# Altium schematic sheet RX_old.SchDoc: {Наименование}
size 420 x 297 mm; DocumentNumber: ПЛАС.ХХХХХХ.ХХХ ХХ; SheetNumber: {}; SheetTotal: {}; PageSetup: Record=PageOptions|CenterHorizontal=False|CenterVertical=False|PrintScale=0.95|XCorrection=0.00|YCorrection=0.00|PrintKind=1|BorderSize=5000000|LeftOffset=0|BottomOffset=0|Orientation=1|PaperLength=1000|PaperWidth=1000|Scale=100|PaperSource=15|PrintQuality=600|MediaType=1|DitherType=10|PaperKind=A4|PrintScaleMode=1; Rule: PcbType=ProtelPcb
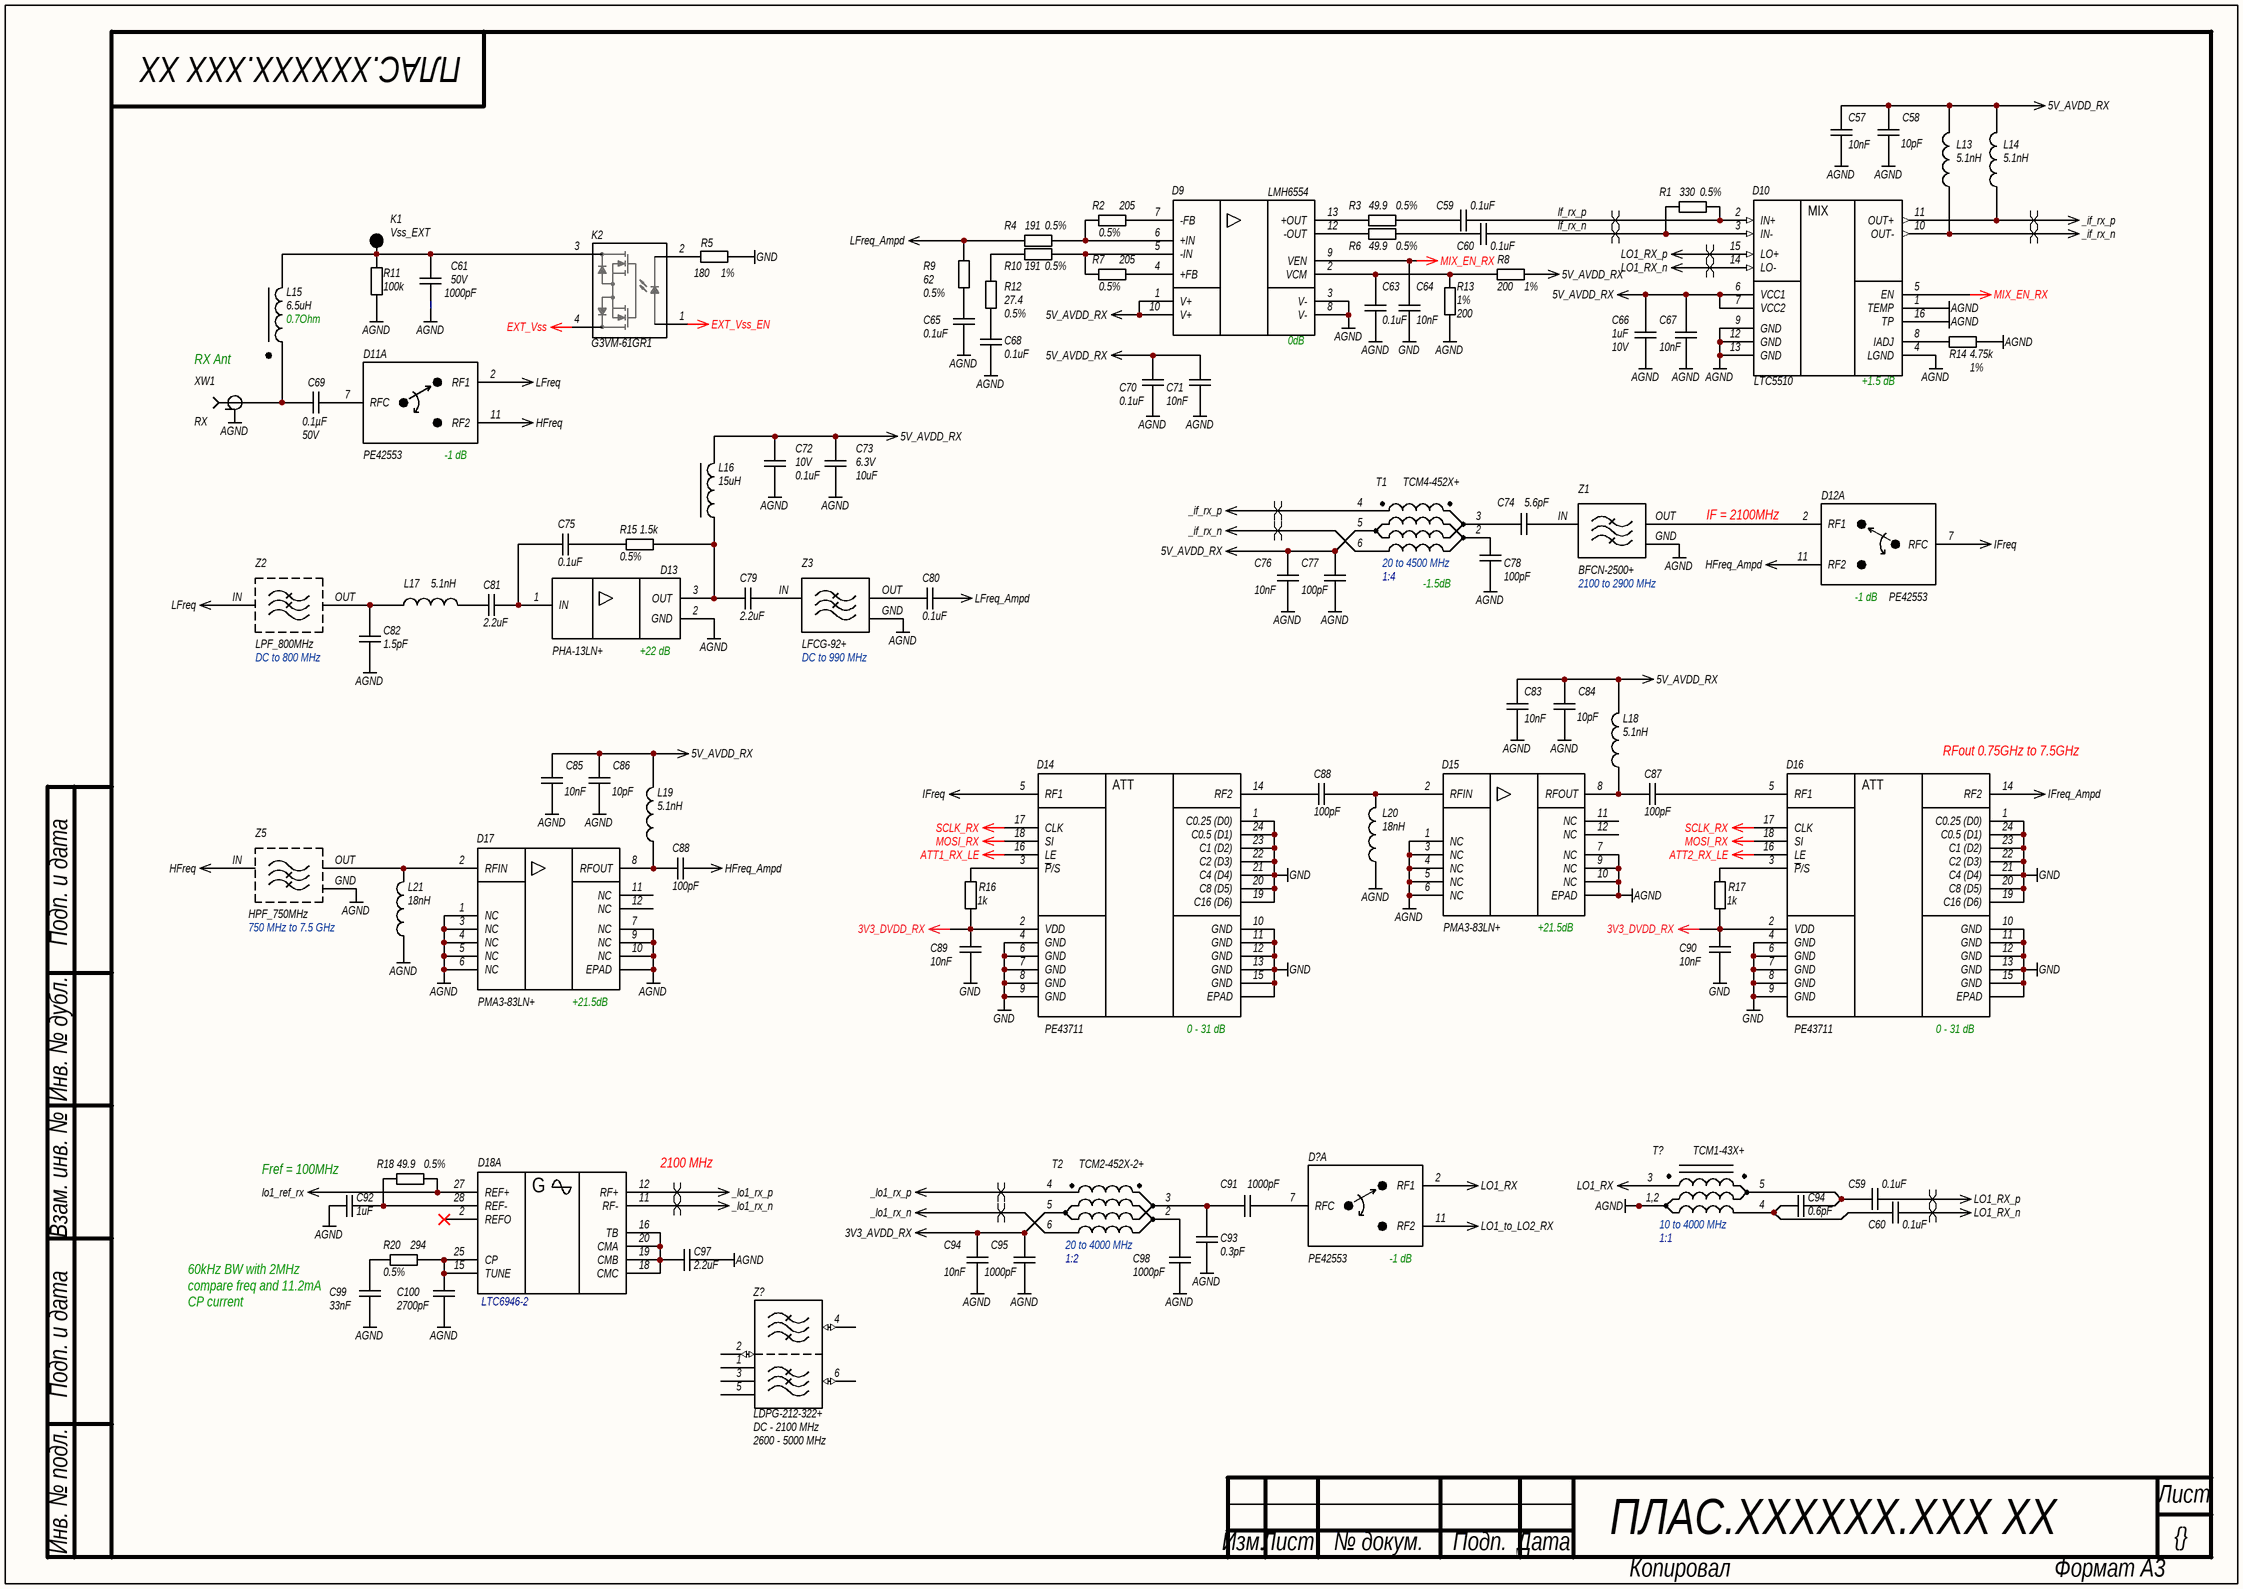
[diagram p0: RX_old.SchDoc]

## Parts
(Parts that share a designator on the sheet are numbered #1, #2 ... from top to bottom, then left to right.)
C57  value 10nF  [C0402]  (hidden comment: CAP)
C58  value 10pF  [C0402]  (hidden comment: CAP)
C59#1  value 0.1uF  [C0402]  (hidden comment: CAP)
C59#2  value 0.1uF  [C0402]  (hidden comment: CAP)
C60#1  value 0.1uF  [C0402]  (hidden comment: CAP)
C60#2  value 0.1uF  [C0402]  (hidden comment: CAP)
C61  value 1000pF  Voltage: 50V  [C0402]  (hidden comment: CAP)
C63  value 0.1uF  [C0402]  (hidden comment: CAP)
C64  value 10nF  [C0402]  (hidden comment: CAP)
C65  value 0.1uF  [C0402]  (hidden comment: CAP)
C66  value 1uF  Voltage: 10V  [C0805]  (hidden comment: CAP)
C67  value 10nF  [C0402]  (hidden comment: CAP)
C68  value 0.1uF  [C0402]  (hidden comment: CAP)
C69  value 0.1µF  Voltage: 50V  [C1206]  (hidden comment: CAP)
C70  value 0.1uF  [C0402]  (hidden comment: CAP)
C71  value 10nF  [C0402]  (hidden comment: CAP)
C72  value 0.1uF  Voltage: 10V  [C0402]  (hidden comment: CAP)
C73  value 10uF  Voltage: 6.3V  [C0805]  (hidden comment: CAP)
C74  value 5.6pF  [C0402]  (hidden comment: CAP)
C75  value 0.1uF  [C0402]  (hidden comment: CAP)
C76  value 10nF  [C0402]  (hidden comment: CAP)
C77  value 100pF  [C0402]  (hidden comment: CAP)
C78  value 100pF  [C0402]  (hidden comment: CAP)
C79  value 2.2uF  [C0603]  (hidden comment: CAP)
C80  value 0.1uF  [C0402]  (hidden comment: CAP)
C81  value 2.2uF  [C0603]  (hidden comment: CAP)
C82  value 1.5pF  [C0402]  (hidden comment: CAP)
C83  value 10nF  [C0402]  (hidden comment: CAP)
C84  value 10pF  [C0402]  (hidden comment: CAP)
C85  value 10nF  [C0402]  (hidden comment: CAP)
C86  value 10pF  [C0402]  (hidden comment: CAP)
C87  value 100pF  [C0402]  (hidden comment: CAP)
C88#1  value 100pF  [C0402]  (hidden comment: CAP)
C88#2  value 100pF  [C0402]  (hidden comment: CAP)
C89  value 10nF  [C0402]  (hidden comment: CAP)
C90  value 10nF  [C0402]  (hidden comment: CAP)
C91  value 1000pF  [C0402]  (hidden comment: CAP)
C92  value 1uF  [C0805]  (hidden comment: CAP)
C93  value 0.3pF  [C0402]  (hidden comment: CAP)
C94#1  value 0.6pF  [C0402]  (hidden comment: CAP)
C94#2  value 10nF  [C0402]  (hidden comment: CAP)
C95  value 1000pF  [C0402]  (hidden comment: CAP)
C97  value 2.2uF  [C0603]  (hidden comment: CAP)
C98  value 1000pF  [C0402]  (hidden comment: CAP)
C99  value 33nF  [C1206]  (hidden comment: CAP)
C100  value 2700pF  [C0805]  (hidden comment: CAP)
D9  LMH6554  [UQFN-14_2]
D10  LTC5510  [PQFN-16]
D11  PE42553  [QFN-16]  (part A of 2)
D12  PE42553  [QFN-16]  (part A of 2)
D13  PHA-13LN+  [SOT89]
D14  PE43711  [QFN-24]
D15  PMA3-83LN+  [DQ1225]
D16  PE43711  [QFN-24]
D17  PMA3-83LN+  [DQ1225]
D18  Name: LTC6946-2  [QFN-28]  (hidden comment: LTC6946)  (part A of 2)
D?  PE42553  [QFN-16]  (part A of 2)
K1  Vss_EXT  [Control Point]
K2  G3VM-61GR1  [G3VM-61]
L13  value 5.1nH  [L0603_HP]  (hidden comment: Inductor RF)
L14  value 5.1nH  [L0603_HP]  (hidden comment: Inductor RF)
L15  value 6.5uH  DCR: 0.7Ohm  [BCR-272]  (hidden comment: Inductor_BCR)
L16  value 15uH  [L1008_LS]  (hidden comment: Inductor)
L17  value 5.1nH  [L0603_HP]  (hidden comment: Inductor RF)
L18  value 5.1nH  [L0603_HP]  (hidden comment: Inductor RF)
L19  value 5.1nH  [L0603_HP]  (hidden comment: Inductor RF)
L20  value 18nH  [L0603_HP]  (hidden comment: Inductor RF)
L21  value 18nH  [L0402]  (hidden comment: Inductor RF)
R1  value 330  Tolerance: 0.5%  [R0402]  (hidden comment: RES)
R2  value 205  Tolerance: 0.5%  [R0402]  (hidden comment: RES)
R3  value 49.9  Tolerance: 0.5%  [R0402]  (hidden comment: RES)
R4  value 191  Tolerance: 0.5%  [R0402]  (hidden comment: RES)
R5  value 180  Tolerance: 1%  [R0402]  (hidden comment: RES)
R6  value 49.9  Tolerance: 0.5%  [R0402]  (hidden comment: RES)
R7  value 205  Tolerance: 0.5%  [R0402]  (hidden comment: RES)
R8  value 200  Tolerance: 1%  [R0402]  (hidden comment: RES)
R9  value 62  Tolerance: 0.5%  [R0402]  (hidden comment: RES)
R10  value 191  Tolerance: 0.5%  [R0402]  (hidden comment: RES)
R11  value 100k  [R0402]  (hidden comment: RES)
R12  value 27.4  Tolerance: 0.5%  [R0402]  (hidden comment: RES)
R13  value 200  Tolerance: 1%  [R0402]  (hidden comment: RES)
R14  value 4.75k  Tolerance: 1%  [R0402]  (hidden comment: RES)
R15  value 1.5k  Tolerance: 0.5%  [R0402]  (hidden comment: RES)
R16  value 1k  [R0402]  (hidden comment: RES)
R17  value 1k  [R0402]  (hidden comment: RES)
R18  value 49.9  Tolerance: 0.5%  [R0402]  (hidden comment: RES)
R20  value 294  Tolerance: 0.5%  [R0603]  (hidden comment: RES)
T1  TCM4-452X+  Frequency: 20 to 4500 MHz  Ratio: 1:4  [DB1627]
T2  TCM2-452X-2+  Frequency: 20 to 4000 MHz  Ratio: 1:2  [DB1627]
T?  TCM1-43X+  Frequency: 10 to 4000 MHz  Ratio: 1:1  [DB1627]
XW1  RX  [MOLEX SD-73251-135 (Gold)]
Z1  BFCN-2500+  Frequency: 2100 to 2900 MHz  [FV1206-4]
Z2  LPF_800MHz  Frequency: DC to 800 MHz  [LPF_800MHz_305um]  (net tie, no BOM)
Z3  LFCG-92+  Frequency: DC to 990 MHz  [GE0805C-2]
Z5  HPF_750MHz  Frequency: 750 MHz to 7.5 GHz  [HPF_750_305um]  (net tie)
Z?  LDPG-212-322+  Low Pass: DC - 2100 MHz  High Pass: 2600 - 5000 MHz  [GE0805C-10]

## Nets
3V3_AVDD_RX: C94#2.2 C95.1 T2.5
3V3_DVDD_RX: C89.2 C90.2 D14.2(VDD) D16.2(VDD) R16.1 R17.1
5V_AVDD_RX: C57.2 C58.2 C66.1 C67.2 C70.2 C71.2 C72.2 C73.2 C76.2 C77.2 C83.2 C84.2 C85.1 C86.2 D9.1(V+) D9.10(V+) D10.6(VCC1) D10.7(VCC2) L13.2 L14.2 L16.2 L18.2 L19.2 R8.2 T1.5
_if_rx_n: D10.10(OUT-) L13.1 T1.6
_if_rx_p: D10.11(OUT+) L14.1 T1.4
_lo1_rx_n: D18.11(RF-) T2.6
_lo1_rx_p: D18.12(RF+) T2.4
AGND: C57.1 C58.1 C61.1 C63.1 C65.2 C66.2 C67.1 C68.2 C70.1 C71.1 C72.1 C73.1 C76.1 C77.1 C78.1 C82.1 C83.1 C84.1 C85.2 C86.1 C92.2 C93.1 C94#2.1 C95.2 C97.1 C98.2 C99.1 C100.1 D9.3(V-) D9.8(V-) D10.1(TEMP) D10.4(LGND) D10.9(GND) D10.12(GND) D10.13(GND) D10.16(TP) D13.2(GND) D15.1(NC) D15.3(NC) D15.4(NC) D15.5(NC) D15.6(NC) D15.7(NC) D15.9(NC) D15.10(NC) D15.13(EPAD) D17.1(NC) D17.3(NC) D17.4(NC) D17.5(NC) D17.6(NC) D17.7(NC) D17.9(NC) D17.10(NC) D17.13(EPAD) L20.1 L21.1 R11.1 R13.2 R14.1 T?.1(1,2) T?.2 XW1.G(GND) Z1.GND Z3.GND Z5.GND
ATT1_RX_LE: D14.16(LE)
ATT2_RX_LE: D16.16(LE)
EXT_Vss: K2.4
EXT_Vss_EN: K2.1
GND: C64.1 C89.1 C90.1 D14.1(C0.25_(D0)) D14.4(GND) D14.6(GND) D14.7(GND) D14.8(GND) D14.9(GND) D14.10(GND) D14.11(GND) D14.12(GND) D14.13(GND) D14.15(GND) D14.19(C16_(D6)) D14.20(C8_(D5)) D14.21(C4_(D4)) D14.22(C2_(D3)) D14.23(C1_(D2)) D14.24(C0.5_(D1)) D14.25(EPAD) D16.1(C0.25_(D0)) D16.4(GND) D16.6(GND) D16.7(GND) D16.8(GND) D16.9(GND) D16.10(GND) D16.11(GND) D16.12(GND) D16.13(GND) D16.15(GND) D16.19(C16_(D6)) D16.20(C8_(D5)) D16.21(C4_(D4)) D16.22(C2_(D3)) D16.23(C1_(D2)) D16.24(C0.5_(D1)) D16.25(EPAD) R5.2
HFreq: D11.11(RF2) Z5.IN
HFreq_Ampd: C88#2.2 D12.11(RF2)
IFreq: D12.7(RFC) D14.5(RF1)
IFreq_Ampd: D16.14(RF2)
LFreq: D11.2(RF1) Z2.IN
LFreq_Ampd: C80.1 R4.2 R9.2
lo1_ref_rx: D18.27(REF+) R18.1
LO1_RX: D?.2(RF1) T?.3
LO1_RX_n: C60#2.1 D10.14(LO-)
LO1_RX_p: C59#2.1 D10.15(LO+)
LO1_to_LO2_RX: D?.11(RF2)
MIX_EN_RX: C64.2 D9.9(VEN) D10.5(EN)
MOSI_RX: D14.18(SI) D16.18(SI)
SCLK_RX: D14.17(CLK) D16.17(CLK)
lf_rx_n: C60#1.1 D10.3(IN-) R1.1
lf_rx_p: C59#1.1 D10.2(IN+) R1.2
NetC59#1_2: C59#1.2 R3.1
NetC59#2_2: C59#2.2 C94#1.2 T?.5
NetC60#1_2: C60#1.2 R6.1
NetC60#2_2: C60#2.2 C94#1.1 T?.4
NetC61_2: C61.2 K1.1 K2.3 L15.2 R11.2
NetC63_2: C63.2 D9.2(VCM) R8.1 R13.1
NetC65_1: C65.1 R9.1
NetC68_1: C68.1 R12.1
NetC69_1: C69.1 L15.1 XW1.S(RF)
NetC69_2: C69.2 D11.7(RFC)
NetC74_1: C74.1 Z1.IN
NetC74_2: C74.2 T1.3
NetC75_1: C75.1 C81.2 D13.1(IN)
NetC75_2: C75.2 R15.2
NetC78_2: C78.2 T1.2
NetC79_1: C79.1 D13.3(OUT) L16.1 R15.1
NetC79_2: C79.2 Z3.IN
NetC80_2: C80.2 Z3.OUT
NetC81_1: C81.1 L17.2
NetC82_2: C82.2 L17.1 Z2.OUT
NetC87_1: C87.1 D15.8(RFOUT) L18.1
NetC87_2: C87.2 D16.5(RF1)
NetC88#1_1: C88#1.1 D14.14(RF2)
NetC88#1_2: C88#1.2 D15.2(RFIN) L20.2
NetC88#2_1: C88#2.1 D17.8(RFOUT) L19.1
NetC91_1: C91.1 C93.2 T2.3
NetC91_2: C91.2 D?.7(RFC)
NetC92_1: C92.1 D18.28(REF-) R18.2
NetC97_2: C97.2 D18.16(TB) D18.18(CMC) D18.19(CMB) D18.20(CMA)
NetC98_1: C98.1 T2.2
NetC99_2: C99.2 R20.2
NetC100_2: C100.2 D18.15(TUNE) D18.25(CP) R20.1
NetD9_4: D9.4(+FB) R7.2
NetD9_5: D9.5(-IN) R7.1 R10.1
NetD9_6: D9.6(+IN) R2.1 R4.1
NetD9_7: D9.7(-FB) R2.2
NetD9_12: D9.12(-OUT) R6.2
NetD9_13: D9.13(+OUT) R3.2
NetD10_8: D10.8(IADJ) R14.2
NetD12_2: D12.2(RF1) Z1.OUT
NetD14_3: D14.3(~{P}/S) R16.2
NetD16_3: D16.3(~{P}/S) R17.2
NetD17_2: D17.2(RFIN) L21.2 Z5.OUT
NetK2_2: K2.2 R5.1
NetR10_2: R10.2 R12.2

Not connected (* = marked no-connect by the designer): D15 11(NC) 12(NC); D17 11(NC) 12(NC); D18 2(REFO)*; Z? 1(GND) 2 3(GND) 4 5(GND) 6

## Layout directives
differential pair: _if_rx_n, _if_rx_p, _lo1_rx_n, _lo1_rx_p, lf_rx_n, lf_rx_p, LO1_RX_n, LO1_RX_p

## Notes on the sheet
- RX Ant
- (near D9) 0dB
- (near D12) IF = 2100MHz
- -1.5dB
- (near D16) RFout 0.75GHz to 7.5GHz
- Fref = 100MHz
- (near D18) 2100 MHz
- 60kHz BW with 2MHz compare freq and 11.2mA CP current
- Подп. и дата
- Инв. № дубл.
- Взам. инв. №
- Инв. № подл.
- Лист
- Изм.
- № докум.
- Подп.
- Дата
- Копировал
- Формат А3
- (in symbol LTC5510) MIX; +1.5 dB
- (in symbol LTC6946, part A) G
- (in symbol PE42553, part A) -1 dB
- (in symbol PE43711) ATT; 0 - 31 dB
- (in symbol PHA-13LN+) +22 dB
- (in symbol PMA3-83LN+) +21.5dB

## Library data of the parts
C57 C64 C67 C71 C76 C83 C89 C90 C94#2 = CAP: SMD Capacitor; Manufacturer: Murata; Material: X7R; Tolerance: 10%; Voltage: 25V; Type: Ceramic Capacitor; P/N: GRM155R71E103KA01D
C58 C84 C86 = CAP: SMD Capacitor; Manufacturer: Murata; Material: NP0; Tolerance: 1%; Voltage: 50V; Type: Ceramic Capacitor; P/N: GRM1555C1H100FA01D
C59#1 C59#2 C60#1 C60#2 C63 C65 C68 C70 C75 C80 = CAP: SMD Capacitor; Manufacturer: Murata; Material: X7R; Tolerance: 10%; Voltage: 10V; Type: Ceramic Capacitor; P/N: GRM155R71A104KA01J
C61 = CAP: SMD Capacitor; Manufacturer: Murata; Material: NP0; Tolerance: 5%; Type: Ceramic Capacitor; P/N: GRM1555C1H102JA01D
C66 = CAP: SMD Capacitor; Manufacturer: Murata; Material: X7R; Tolerance: 10%; Type: Ceramic Capacitor; P/N: GRM21BR71A105KA01K
C69 = CAP: SMD Capacitor; Manufacturer: Murata; Material: NP0; Tolerance: 5%; Type: Ceramic Capacitor; P/N: GRM31C5C1H104JA01K
C72 = CAP: SMD Capacitor; Manufacturer: Murata; Material: X7R; Tolerance: 10%; Type: Ceramic Capacitor; P/N: GRM155R71A104KA01J
C73 = CAP: SMD Capacitor; Manufacturer: Murata; Material: X7R; Tolerance: 10%; Type: Ceramic Capacitor; P/N: GRM21BR70J106KA73L
C74 = CAP: SMD Capacitor; Manufacturer: Murata; Material: NP0; Tolerance: 0.1; Voltage: 50V; Type: Ceramic Capacitor; P/N: GRM1555C1H5R6BA01D
C77 C78 C87 C88#1 C88#2 = CAP: SMD Capacitor; Manufacturer: Murata; Material: NP0; Tolerance: 1%; Voltage: 50V; Type: Ceramic Capacitor; P/N: GRM1555C1H101FA01D
C79 C81 C97 = CAP: SMD Capacitor; Manufacturer: Murata; Material: X7R; Tolerance: 10%; Voltage: 10V; Type: Ceramic Capacitor; P/N: GRM188R71A225KE15J
C82 = CAP: SMD Capacitor; Manufacturer: Murata; Material: NP0; Tolerance: ±0.05pF; Voltage: 50V; Type: Ceramic Capacitor; P/N: GRM1555C1H1R5WA01D
C85 = CAP: SMD Capacitor; Manufacturer: Murata; Material: X7R; Tolerance: 5%; Voltage: 50V; Type: Ceramic Capacitor; P/N: GRM155R71H103JA88D
C91 C95 C98 = CAP: SMD Capacitor; Manufacturer: Murata; Material: NP0; Tolerance: 5%; Voltage: 50V; Type: Ceramic Capacitor; P/N: GRM1555C1H102JA01D
C92 = CAP: SMD Capacitor; Manufacturer: Murata; Material: X7R; Tolerance: 10%; Voltage: 10V; Type: Ceramic Capacitor; P/N: GRM21BR71A105KA01K
C93 = CAP: SMD Capacitor; Manufacturer: Murata; Material: NP0; Tolerance: ±0.05pF; Voltage: 50V; Type: Ceramic Capacitor; P/N: GRM1555C1HR30WA01D
C94#1 = CAP: SMD Capacitor; Manufacturer: Murata; Material: NP0; Tolerance: ±0.05pF; Voltage: 50V; Type: Ceramic Capacitor; P/N: GRM1555C1HR60WA01D
C99 = CAP: SMD Capacitor; Manufacturer: Murata; Material: NP0; Tolerance: ±5%; Voltage: 50V; Type: Ceramic Capacitor; P/N: GRM3195C1H333JA01D
C100 = CAP: SMD Capacitor; Manufacturer: Murata; Material: NP0; Tolerance: 1%; Voltage: 50V; Type: Ceramic Capacitor; P/N: GRM2165C1H272FA01D
D9 = LMH6554: Fully Differential Amplifier; Manufacturer: Texas Instruments; Voltage: 5V; Type: The LMH6554 device is a high-performance fully differential amplifier; P/N: LMH6554LEE/NOPB; Name: LMH6554; Package: 14-lead UQFN; Temperature Range: –40°C to 125°C; Supplier 1: Digi-Key; Supplier Part Number 1: LMH6554LEE/NOPBCT-ND
D10 = LTC5510: Differential Amplifier/ADC   Driver; Manufacturer: Linear Technology; Voltage: 5V or 3.3V; Type: High Linearity Active Mixer; P/N: LTC5510IUF#PBF; Name: LTC5510; Package: 16-Lead (4mm × 4mm) QFN; Temperature Range: –40°C to 105°C; Supplier 1: Digi-Key; Supplier Part Number 1: LTC5510IUF#PBF-ND
D11 D12 D? = PE42553: HaRPTM technology-enhanced absorptive SPDT; Manufacturer: Peregrine Technical Solutions; P/N: PE42553A-Z; Type: SPDT RF Switch; Name: PE42553; Package: 16-lead 3 × 3 mm QFN; Supplier 1: Digi-Key; Supplier Part Number 1: 1046-1137-1-ND
D13 = PHA-13LN+: Monolithic Amplifier; Manufacturer: Mini-Circuits; Type: LNA; Voltage: 3 to 5 V; NF: 0.9dB; Name: PHA-13LN+; Package: SOT89; P/N: PHA-13LN+
D14 D16 = PE43711: The PE43711 is a 50Ω, HaRP™ technology-enhanced, 7-bit RF digital step attenuator; Manufacturer: Peregrine Technical Solutions; P/N: PE43711A-Z; Type: 7-bit RF digital step attenuator (DSA); Name: PE43711; Package: 24-lead 4 × 4 × 0.85 mm QFN; Supplier 1: Digi-Key; Supplier Part Number 1: 1046-1138-1-ND
D15 D17 = PMA3-83LN+: Low Noise Amplifier; Manufacturer: Mini-Circuits; Type: LNA; Name: PMA3-83LN+; Package: DQ1225; P/N: PMA3-83LN+
D18 = LTC6946: The LTC®6946 is a high performance, low noise, 6.39GHz  phase-locked loop (PLL); Manufacturer: Linear Technology; Voltage: 3.15 V ~ 5.25 V; Type: Clock/Frequency Synthesizer (RF/IF), Integer N; P/N: LTC6946IUFD-2#PBF; Package: 28-QFN (4x5); Temperature Range: -40°C ~ 105°C; Supplier 1: Digi-Key; Supplier Part Number 1: LTC6946IUFD-2#PBF-ND
K1 = Test  Point
K2 = G3VM-61GR1: MOS FET Relay; Manufacturer: Omron; Channel Resistance: 700 mOhm; Current: 1A; Voltage: 60V; Name: G3VM-61GR1; Package: SOT-23F; P/N: G3VM-61GR1; Supplier 1: Digi-Key; Supplier Part Number 1: Z4069CT-ND
L13 L14 L17-L19 = Inductor RF: Chip SMD Inductor; Manufacturer: Coilcraft; Current: 250mA; Frequency: 5.70GHz; Name: 0603HP-5N1X_E_; Tolerance: 5%; P/N: 0603HP-5N1XJL; Series: 0603HP; Temperature Range: -25…85°C
L15 = Inductor_BCR: Broadband Conical Inductor; Manufacturer: Coilcraft; Current: 650mA; Frequency: 40GHz; Name: BCR-652JL; Tolerance: ±5%; P/N: BCR-652JLB; Series: BCR-272; Temperature Range: -25…85°C
L16 = Inductor: Chip SMD Inductor; Manufacturer: Coilcraft; Current: 280mA; Frequency: 30MHz; Name: 1008LS-153XJE; Tolerance: ±5%; Series: 1008LS; Temperature Range: -25…85°C; P/N: 1008LS-153XJE
L20 = Inductor RF: Chip SMD Inductor; Manufacturer: Coilcraft; Current: 1200mA; Frequency: 3.30GHz; Name: 0603HP-18NXJE; Tolerance: 5%; Series: 0603HP; Temperature Range: -25…85°C; P/N: 0603HP-18NXJE
L21 = Inductor RF: Chip SMD Inductor; Manufacturer: Murata; Current: 400mA; Frequency: 2200MHz; Name: LQG15H; Tolerance: 5%; P/N: LQG15HS18NJ02D; Series: LQG; Temperature Range: -25…85°C
R1 = RES: SMD Resistor; Manufacturer: Panasonic Electronic Components; Name: Chip SMD Resistor; Power: 0.063 Wt; P/N: ERJ-2RHD3300X; Temperature Range: -55…155°C
R2 R7 = RES: SMD Resistor; Manufacturer: Panasonic Electronic Components; Name: Chip SMD Resistor; Power: 0.063 Wt; P/N: ERJ-2RHD2050X; Temperature Range: -55…155°C
R3 R6 R18 = RES: SMD Resistor; Manufacturer: Panasonic Electronic Components; Name: Chip SMD Resistor; Power: 0.063 Wt; P/N: ERJ-2RKD49R9X; Temperature Range: -55…155°C
R4 R10 = RES: SMD Resistor; Manufacturer: Panasonic Electronic Components; Name: Chip SMD Resistor; Power: 0.063 Wt; P/N: ERJ-2RHD1910X; Temperature Range: -55…155°C
R5 = RES: SMD Resistor; Manufacturer: Panasonic Electronic Components; Name: Chip SMD Resistor; Power: 0.063 Wt; P/N: ERJ-2RKF1800X; Temperature Range: -55…155°C
R8 R13 = RES: SMD Resistor; Manufacturer: Panasonic Electronic Components; Name: Chip SMD Resistor; Power: 0.063 Wt; P/N: ERJ-2RKF2000X; Temperature Range: -55…155°C
R9 = RES: SMD Resistor; Manufacturer: Panasonic Electronic Components; Name: Chip SMD Resistor; Power: 0.063 Wt; P/N: ERJ-2RKD62R0X; Temperature Range: -55…155°C
R11 = RES: SMD Resistor; Manufacturer: Panasonic Electronic Components; Name: Chip SMD Resistor; Power: 0.1 Wt; Tolerance: 1%; P/N: ERJ-2RKF1003X; Temperature Range: -55…155°C
R12 = RES: SMD Resistor; Manufacturer: Panasonic Electronic Components; Name: Chip SMD Resistor; Power: 0.063 Wt; P/N: ERJ-2RKD27R4X; Temperature Range: -55…155°C
R14 = RES: SMD Resistor; Manufacturer: Panasonic Electronic Components; Name: Chip SMD Resistor; Power: 0.1 Wt; P/N: ERJ-2RKF4751X; Temperature Range: -55…155°C
R15 = RES: SMD Resistor; Manufacturer: Panasonic Electronic Components; Name: Chip SMD Resistor; Power: 0.063 Wt; P/N: ERJ-2RHD1501X; Temperature Range: -55…155°C
R16 R17 = RES: SMD Resistor; Name: Chip SMD Resistor; Power: 0.062 Wt; Tolerance: 5%; P/N: ERJ-2GEJ102X; Temperature Range: -55…155°C
R20 = RES: SMD Resistor; Manufacturer: Panasonic Electronic Components; Name: Chip SMD Resistor; Power: 0.2 Wt; P/N: ERJ-PB3D2940V; Temperature Range: -55…155°C
T1 = TCM4-452X+: RF Transformer; Manufacturer: Mini-Circuits; Name: TCM3-452X+; P/N: TCM3-452X+; Type: RF Transformer; Package: DB1627
T2 = TCM2-452X-2+: RF Transformer; Manufacturer: Mini-Circuits; Name: TCM2-452X-2+; P/N: TCM2-452X-2+; Type: RF Transformer; Package: DB1627
T? = TCM1-43X+: RF Transformer; Manufacturer: Mini-Circuits; Name: TCM1-43X+; P/N: TCM1-43X+; Type: RF Transformer; Package: DB1627
XW1 = RF Connector: 50 Ohms, SMA Jack, Vertica; Manufacturer: Molex; Impedance: 50Ω; P/N: 0732511352; Name: SMA Jack; Type: 50 Ohms, SMA Jack, Vertical, PCB SMT, Gold (Au) Body; Supplier 1: Digi-Key; Supplier Part Number 1: WM9458-ND
Z1 = BFCN-2500+: Bandpass Filter; Manufacturer: Mini-Circuits; Name: BFCN-2500+; P/N: BFCN-2500+; Type: Bandpass Filter; Package: FV1206-4
Z2 = LPF_800MHz: Low Pass Filter; Name: Distributed low pass fiter; Type: Stripline Low Pass Filter
Z3 = LFCG-92+: Low Pass Filter; Manufacturer: Mini-Circuits; Name: LFCG-92+; P/N: LFCG-92+; Type: Low Pass Filter; Package: GE0805C-2
Z5 = HPF_750MHz: High Pass Filter; C1: 9.0pF; P/N: GRM1555C1H3R0WA01D; C2: 3.0pF; Name: Distributed high pass filter; Tolerance: 1%; Type: Stripline High Pass Filter; C3: 9.0pF
Z? = LDPG-212-322+: Diplexer; Manufacturer: Mini-Circuits; Frequency: DC to 5000 MHz; Name: LDPG-212-322+; P/N: LDPG-212-322+; Type: Diplexer; Package: GE0805C-10